# Altium schematic sheet Dash22_ENCOD.SchDoc
size A
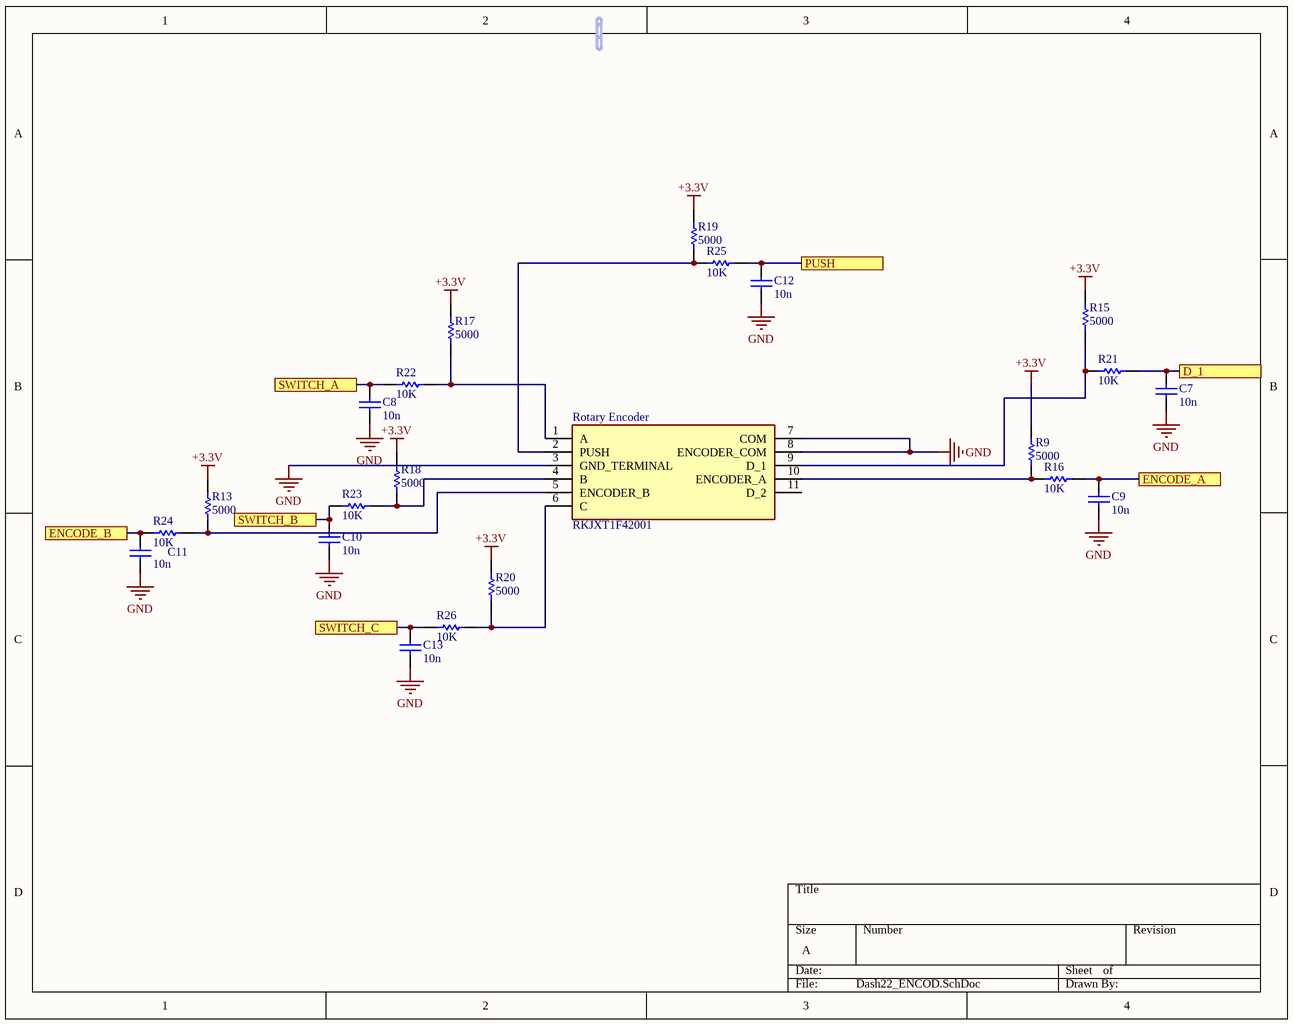
[diagram p0: Dash22_ENCOD.SchDoc]

## Parts
C7  10n  [CAPC1608X90X35ML10T15]
C8  10n  [CAPC1608X90X35ML10T15]
C9  10n  [CAPC1608X90X35ML10T15]
C10  10n  [CAPC1608X90X35ML10T15]
C11  10n  [CAPC1608X90X35ML10T15]
C12  10n  [CAPC1608X90X35ML10T15]
C13  10n  [CAPC1608X90X35ML10T15]
R9  5000  [RESC1608X55X25ML10T15]
R13  5000  [RESC1608X55X25ML10T15]
R15  5000  [RESC1608X55X25ML10T15]
R16  10K  [RESC1608X55X25ML10T15]
R17  5000  [RESC1608X55X25ML10T15]
R18  5000  [RESC1608X55X25ML10T15]
R19  5000  [RESC1608X55X25ML10T15]
R20  5000  [RESC1608X55X25ML10T15]
R21  10K  [RESC1608X55X25ML10T15]
R22  10K  [RESC1608X55X25ML10T15]
R23  10K  [RESC1608X55X25ML10T15]
R24  10K  [RESC1608X55X25ML10T15]
R25  10K  [RESC1608X55X25ML10T15]
R26  10K  [RESC1608X55X25ML10T15]
Rotary_Encoder  RKJXT1F42001  [RKJXT1F42001]

## Ports
D_1, ENCODE_A, ENCODE_B, PUSH, SWITCH_A, SWITCH_B, SWITCH_C

## Nets
+3.3V: R9.2 R13.2 R15.2 R17.2 R18.2 R19.2 R20.2
GND: C7.1 C8.1 C9.1 C10.1 C11.1 C12.1 C13.1 Rotary_Encoder.3(GND_TERMINAL) Rotary_Encoder.7(COM) Rotary_Encoder.8(ENCODER_COM)
D_1: C7.2 R21.2 ; port D_1
ENCODE_A: C9.2 R16.2 ; port ENCODE_A
ENCODE_B: C11.2 R24.1 ; port ENCODE_B
PUSH: C12.2 R25.2 ; port PUSH
SWITCH_A: C8.2 R22.1 ; port SWITCH_A
SWITCH_B: C10.2 R23.1 ; port SWITCH_B
SWITCH_C: C13.2 R26.1 ; port SWITCH_C
NetR9_1: R9.1 R16.1 Rotary_Encoder.10(ENCODER_A)
NetR13_1: R13.1 R24.2 Rotary_Encoder.5(ENCODER_B)
NetR15_1: R15.1 R21.1 Rotary_Encoder.9(D_1)
NetR17_1: R17.1 R22.2 Rotary_Encoder.1(A)
NetR18_1: R18.1 R23.2 Rotary_Encoder.4(B)
NetR19_1: R19.1 R25.1 Rotary_Encoder.2(PUSH)
NetR20_1: R20.1 R26.2 Rotary_Encoder.6(C)

Not connected (* = marked no-connect by the designer): Rotary_Encoder 11(D_2)

## Library data of the parts
C7-C13 = CMP-2100-03642-1: Chip Capacitor, 10 nF, +/- 10%, 50 V, -55 to 125 degC, 0603 (1608 Metric), RoHS, Tape and Reel; Manufacturer: Murata; Insulation Resistance: 10GR; Dielectric: X7R; Voltage Rating: 50V; Capacitance: 10nF; Material: Ceramic; Package Quantity: 1; Lead Free: LeadFree; Case/Package: 0603; Termination: SMD/SMT; REACH SVHC: Unknown; Manufacturer URL: http://www.murata.com/; Datasheet URL: http://search.murata.co.jp/Ceramy/image/img/A01X/G101/ENG/GRM188R71H103KA01-01.pdf; Mount: SurfaceMount; Datasheet Version: 42401.0; Number of Pins: 2; Length: 1.6mm; Voltage: 50V; Depth: 0.8mm; Tolerance: 10%; Min Operating Temperature: -55degC; Voltage Rating (DC): 50V; Max Operating Temperature: 125degC; Package Description: 2-Pin Surface Mount Device, Body 1.6 x 0.8 mm; RoHSCompliant: True; Case Code (Imperial): 0603; Width: 0.031inch; Case Code (Metric): 1608; Height: 0.8mm; Package Reference: 0603; Packaging: TapeandReel; Thickness: 0.035inch; Dielectric Material: Ceramic
R9 R13 R15-R26 = CMP-009-000010-1: Chip Resistor, 0 Ohm, 0.1 W, -55 to 155 degC, 0603 (1608 Metric); Source: Integrated_Library - 12.03.21 - 15.39.SchLib; Design Item ID: CMP-009-00006-4
Rotary_Encoder = RKJXT1F42001: Switch; Manufacturer_Name: ALPS; Datasheet Link: http://www.alps.com/prod/info/E/HTML/MultiControl/Switch/RKJXT/RKJXT1F42001.html; Height: 17mm; Manufacturer_Part_Number: RKJXT1F42001; Mouser Part Number: 688-RKJXT1F42001; Mouser Price/Stock: https://www.mouser.co.uk/ProductDetail/ALPS/RKJXT1F42001?qs=6EGMNY9ZYDTsBzSTrhiL0w%3D%3D